# EAGLE design MotionSign (EAGLE 9.3.0)
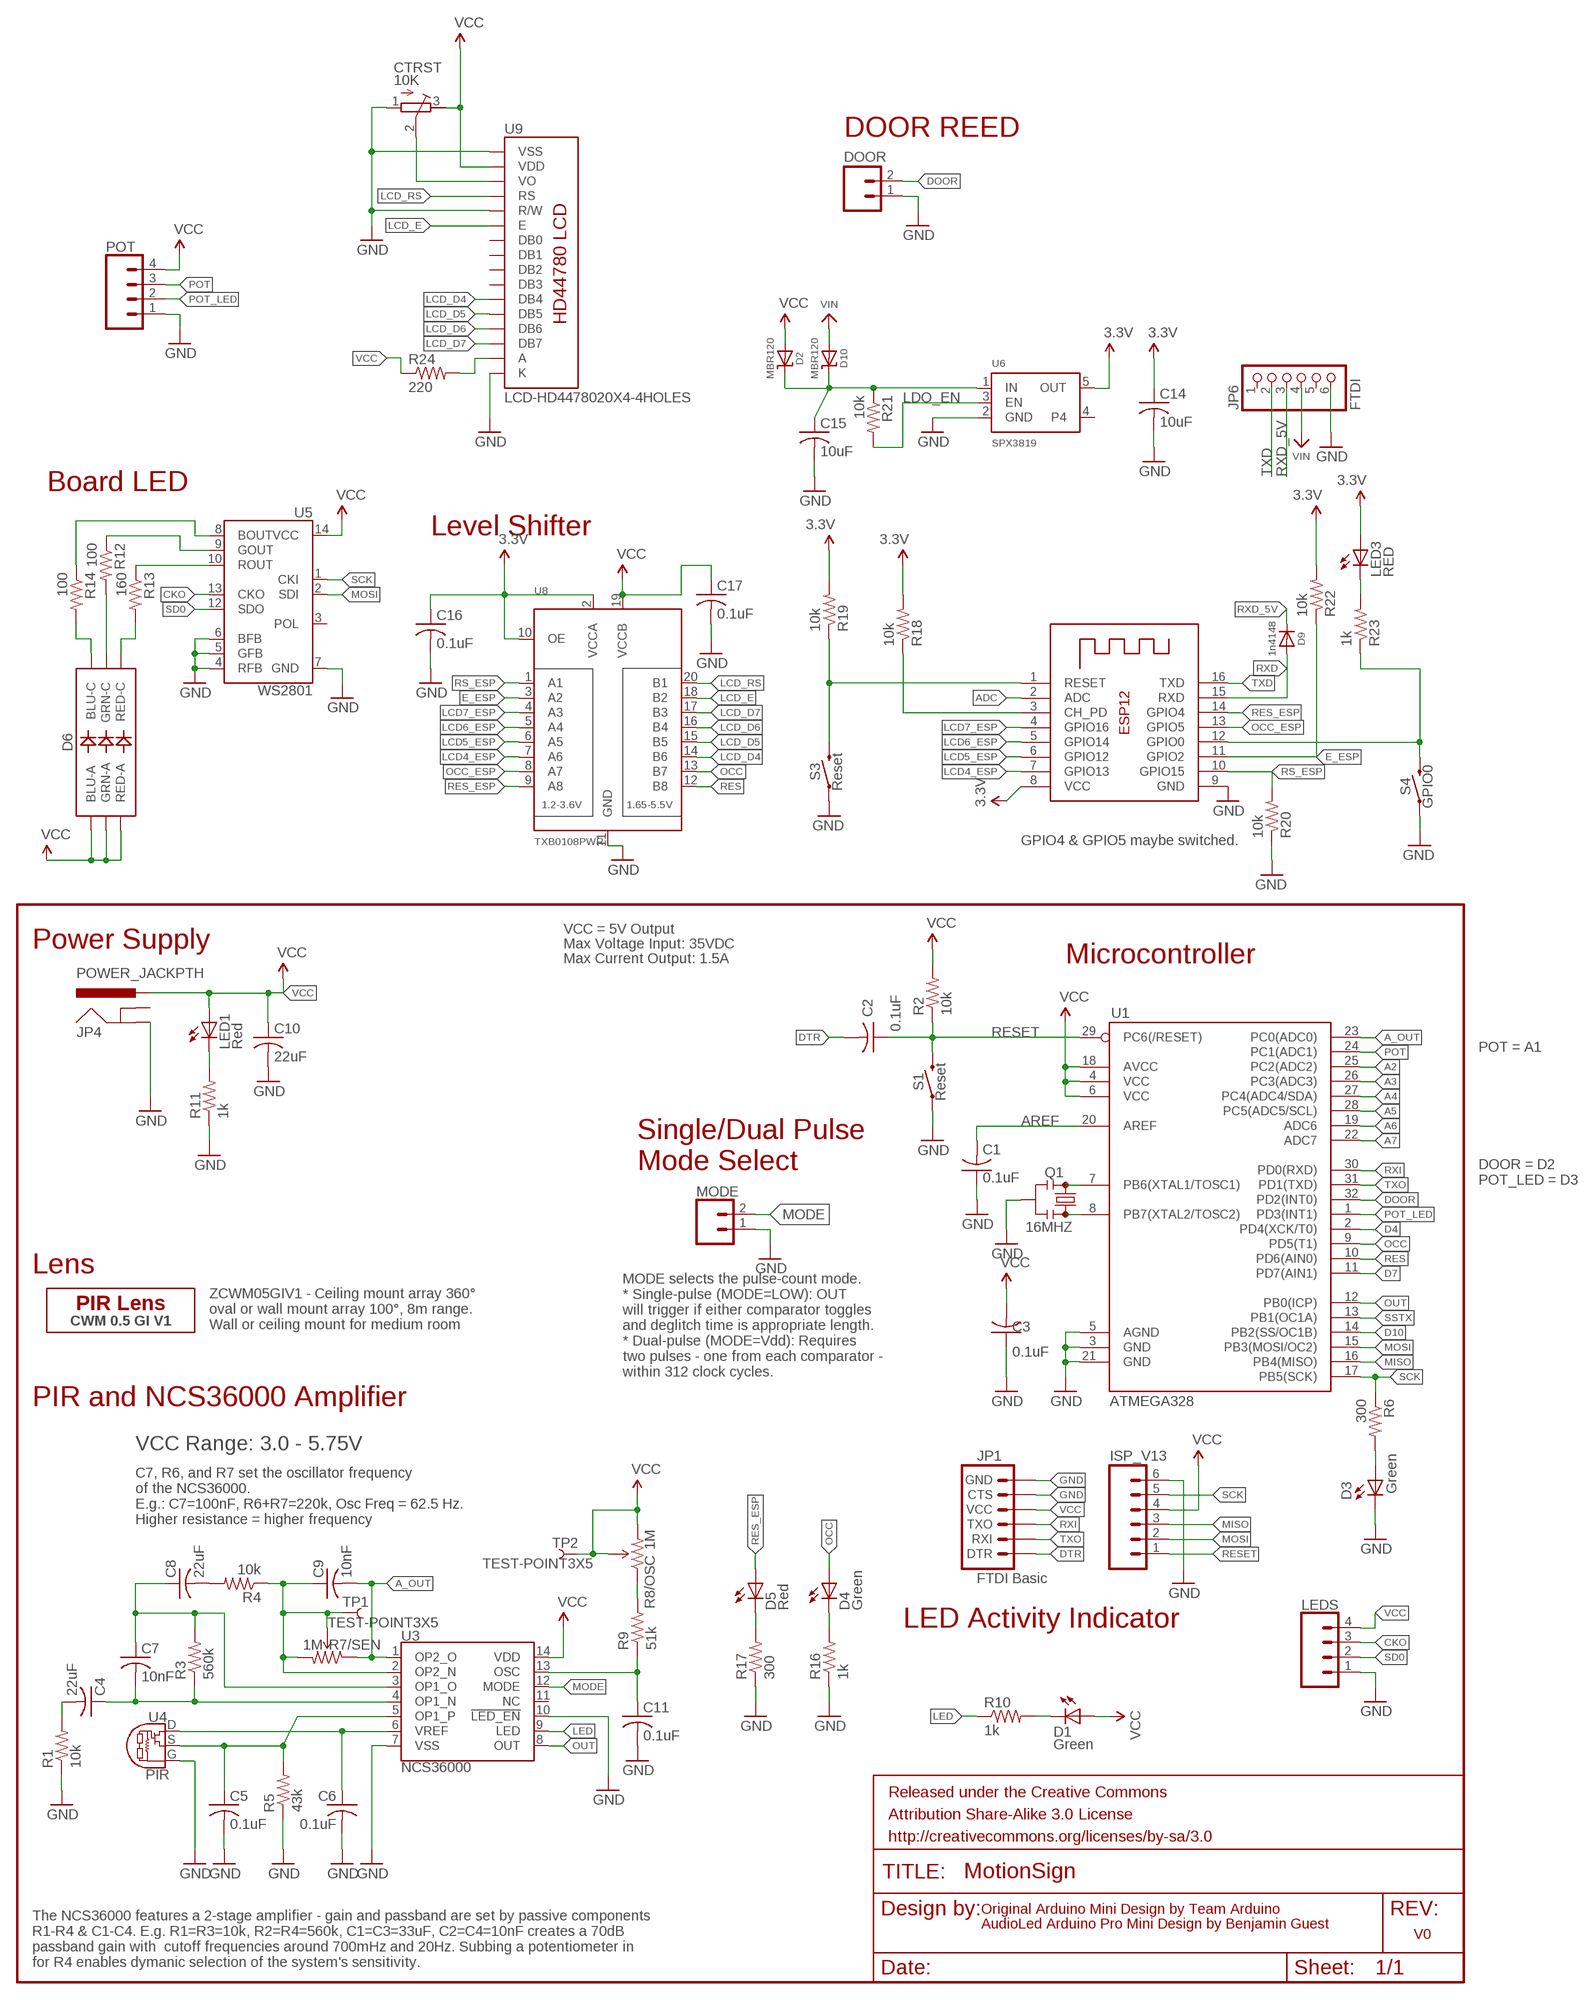
[diagram p0: schematic, sheet 1]

## Parts
C1  0.1uF  C-USC0805  [C0805]
C2  0.1uF  C-USC0805  [C0805]
C3  0.1uF  C-USC0805  [C0805]
C4  22uF  C-USC0805  [C0805]
C5  0.1uF  C-USC0805  [C0805]
C6  0.1uF  C-USC0805  [C0805]
C7  10nF  C-USC0805  [C0805]
C8  22uF  C-USC0805  [C0805]
C9  10nF  C-USC0805  [C0805]
C10  22uF  C-USC0805  [C0805]
C11  0.1uF  C-USC0805  [C0805]
C14  10uF  C-USC0805  [C0805]
C15  10uF  C-USC0805  [C0805]
C16  0.1uF  C-USC0805  [C0805]
C17  0.1uF  C-USC0805  [C0805]
CTRST  10K  R-TRIMM3296W  [RTRIM3296W]
D1  Green  LEDCHIPLED_0805  [CHIPLED_0805]
D2  MBR120  DIODE-SCHOTTKYSOD-123  [SOD-123]
D3  Green  LEDCHIPLED_0805  [CHIPLED_0805]
D4  Green  LEDCHIPLED_0805  [CHIPLED_0805]
D5  Red  LEDCHIPLED_0805  [CHIPLED_0805]
D6  LED-RGBNO_IC  [LED-TRICOLOR-5050]
D9  1n4148  DIODESOD-323  [SOD-323]
D10  MBR120  DIODE-SCHOTTKYSOD-123  [SOD-123]
DOOR  CONN_02JST-PTH-2  [JST-2-PTH]
FRAME1  FRAME-LETTER  [CREATIVE_COMMONS]
ISP_V13  M06SIP  [1X06]
JP1  FTDI Basic  ARDUINO_SERIAL_PROGRAMPTH  [1X06]
JP4  POWER_JACKPTH  [POWER_JACK_PTH]
JP6  FTDI  HEADER-1X670MIL  [1X06_ROUND_70]
LED1  Red  LEDCHIPLED_0805  [CHIPLED_0805]
LED3  RED  LEDCHIP-LED0805  [CHIP-LED0805]
LEDS  CONN_04JST-PTH  [JST-4-PTH]
MODE  CONN_02  [1X02]
POT  CONN_04JST-PTH  [JST-4-PTH]
Q1  16MHZ  RESONATOR16MHZ  [RESONATOR-SMD]
R1  10k  R-US_M0805  [M0805]
R2  10k  R-US_M0805  [M0805]
R3  560k  R-US_M0805  [M0805]
R4  10k  R-US_M0805  [M0805]
R5  43k  R-US_M0805  [M0805]
R6  300  R-US_M0805  [M0805]
R7/SEN  1M  TRIMPOTTX33X-1M  [TRIMPOT-TC33X]
R8/OSC  1M  TRIMPOTTX33X-1M  [TRIMPOT-TC33X]
R9  51k  R-US_M0805  [M0805]
R10  1k  R-US_M0805  [M0805]
R11  1k  R-US_M0805  [M0805]
R12  100  R-US_M0805  [M0805]
R13  160  R-US_M0805  [M0805]
R14  100  R-US_M0805  [M0805]
R16  1k  R-US_M0805  [M0805]
R17  300  R-US_M0805  [M0805]
R18  10k  R-US_M0805  [M0805]
R19  10k  R-US_M0805  [M0805]
R20  10k  R-US_M0805  [M0805]
R21  10k  R-US_M0805  [M0805]
R22  10k  R-US_M0805  [M0805]
R23  1k  R-US_M0805  [M0805]
R24  220  R-US_0204/7  [0204/7]
S1  Reset  MOMENTARY-SWITCH-SPST-SMD-5.2-REDUNDANT  [TACTILE_SWITCH_SMD_5.2MM]
S3  Reset  MOMENTARY-SWITCH-SPST-SMD-5.2-REDUNDANT  [TACTILE_SWITCH_SMD_5.2MM]
S4  GPIO0  MOMENTARY-SWITCH-SPST-SMD-5.2-REDUNDANT  [TACTILE_SWITCH_SMD_5.2MM]
TP1  TEST-POINT3X5  [PAD.03X.05]
TP2  TEST-POINT3X5  [PAD.03X.05]
U1  ATMEGA328  ATMEGA168  [TQFP32-08]
U3  NCS36000  [SO14]
U4  PIR  [PIR]
U5  WS2801  [SOP-14]
U6  SPX3819  VREG_SOT23-5  [SOT23-5]
U8  TXB0108PWR  [TSSOP20]
U9  LCD-HD4478020X4-4HOLES  LCD-HD44780  [LCD-20X4-1HOLE_NOSILK]
U$1  CWM 0.5 GI V1  PIR-LENSCWM-0.5-GI-V1  [LENS-CWM-0.5-GI-V1]
X2  ESP-12  [ESP-12]

## Nets
3.3V: C14.1 C16.1 LED3.A R18.2 R19.2 R22.2 U6.5(OUT) U8.2(VCCA) U8.10(OE) X2.8(VCC)
A2: U1.25(PC2(ADC2))
A3: U1.26(PC3(ADC3))
A4: U1.27(PC4(ADC4/SDA))
A5: U1.28(PC5(ADC5/SCL))
A6: U1.19(ADC6)
A7: U1.22(ADC7)
A_OUT: C9.2 R7/SEN.1(CCW) U1.23(PC0(ADC0)) U3.1(OP2_O)
ADC: X2.2(ADC)
AREF: C1.2 U1.20(AREF)
CH_PD: R18.1 X2.3(CH_PD)
CKO: LEDS.3 U5.13(CKO)
D4: U1.2(PD4(XCK/T0))
D7: U1.11(PD7(AIN1))
D10: U1.14(PB2(SS/OC1B))
DOOR: DOOR.2 U1.32(PD2(INT0))
DTR: C2.2 JP1.1(DTR)
E_ESP: R22.1 U8.3(A2) X2.11(GPIO2)
GND [vcc]: C1.1 C3.1 C5.2 C6.2 C10.2 C11.2 C14.2 C15.2 C16.2 C17.2 CTRST.1(A) D3.C DOOR.1 ISP_V13.6 JP1.5(CTS) JP1.6(GND) JP4.GND JP6.6 LEDS.1 MODE.1 POT.1 Q1.2 R1.1 R5.1 R11.1 R16.1 R17.1 R20.1 S1.1 S1.2 S3.1 S3.2 S4.1 S4.2 U1.3(GND) U1.5(AGND) U1.21(GND) U3.7(VSS) U3.10(!LED_EN!) U4.G U5.4(RFB) U5.5(GFB) U5.6(BFB) U5.7(GND) U6.2(GND) U8.11(GND) U9.P$1(VSS) U9.P$5(R/W) U9.P$16(K) X2.9(GND)
GPIO0: R23.1 S4.3 S4.4 X2.12(GPIO0)
LCD4_ESP: U8.7(A6) X2.7(GPIO13)
LCD5_ESP: U8.6(A5) X2.6(GPIO12)
LCD6_ESP: U8.5(A4) X2.5(GPIO14)
LCD7_ESP: U8.4(A3) X2.4(GPIO16)
LCD_D4: U8.14(B6) U9.P$11(DB4)
LCD_D5: U8.15(B5) U9.P$12(DB5)
LCD_D6: U8.16(B4) U9.P$13(DB6)
LCD_D7: U8.17(B3) U9.P$14(DB7)
LCD_E: U8.18(B2) U9.P$6(E)
LCD_RS: U8.20(B1) U9.P$4(RS)
LDO_EN: R21.2 U6.3(EN)
LED: R10.1 U3.9(LED)
MISO: ISP_V13.3 U1.16(PB4(MISO))
MODE: MODE.2 U3.12(MODE)
MOSI: ISP_V13.2 U1.15(PB3(MOSI/OC2)) U5.2(SDI)
N$1: Q1.3 U1.8(PB7(XTAL2/TOSC2))
N$2: Q1.1 U1.7(PB6(XTAL1/TOSC1))
N$3: C6.1 U3.6(VREF) U4.D
N$4: LED1.C R11.2
N$5: C5.1 R5.2 U3.5(OP1_P) U4.S
N$6: C4.2 R1.2
N$7: D3.A R6.2
N$8: C8.2 R4.2
N$9: C4.1 C7.2 R3.1 U3.4(OP1_N)
N$10: C7.1 C8.1 R3.2 U3.3(OP1_O)
N$11: C9.1 R4.1 R7/SEN.2(WIPER) R7/SEN.3(CW) TP1.P$1 U3.2(OP2_N)
N$12: C11.1 R9.1 U3.13(OSC)
N$13: R8/OSC.1(CCW) R9.2
N$14: D1.C R10.2
N$15: R14.1 U5.8(BOUT)
N$16: R13.1 U5.10(ROUT)
N$17: LED3.C R23.2
N$18: D5.C R17.2
N$19: R12.1 U5.9(GOUT)
N$20: D6.4(BLU-C) R14.2
N$21: D6.6(GRN-C) R12.2
N$22: D6.5(RED-C) R13.2
N$23: C15.1 D2.C D10.C R21.1 U6.1(IN)
N$24: D4.C R16.2
N$25: R24.2 U9.P$15(A)
OCC: D4.A U1.9(PD5(T1)) U8.13(B7)
OCC_ESP: U8.8(A7) X2.13(GPIO5)
OUT: U1.12(PB0(ICP)) U3.8(OUT)
POT: POT.3 U1.24(PC1(ADC1))
POT_LED: POT.2 U1.1(PD3(INT1))
RES: U1.10(PD6(AIN0)) U8.12(B8)
RES_ESP: D5.A U8.9(A8) X2.14(GPIO4)
RESET: C2.1 ISP_V13.1 R2.1 S1.3 S1.4 U1.29(PC6(/RESET))
RESET_HZA: R19.1 S3.3 S3.4 X2.1(RESET)
RS_ESP: R20.2 U8.1(A1) X2.10(GPIO15)
RXD: D9.A X2.15(RXD)
RXD_5V: D9.C JP6.3
RXI: JP1.3(TXO) U1.30(PD0(RXD))
SCK: ISP_V13.5 R6.1 U1.17(PB5(SCK)) U5.1(CKI)
SD0: LEDS.2 U5.12(SDO)
SSTX: U1.13(PB1(OC1A))
TXD: JP6.2 X2.16(TXD)
TXO: JP1.2(RXI) U1.31(PD1(TXD))
VCC [gnd]: C3.2 C10.1 C17.1 CTRST.3(E) D1.A D2.A D6.1(GRN-A) D6.2(RED-A) D6.3(BLU-A) ISP_V13.4 JP1.4(VCC) JP4.PWR LED1.A LEDS.4 POT.4 R2.2 R8/OSC.2(WIPER) R8/OSC.3(CW) R24.1 TP2.P$1 U1.4(VCC) U1.6(VCC) U1.18(AVCC) U3.14(VDD) U5.14(VCC) U8.19(VCCB) U9.P$2(VDD)
VIN: D10.A JP6.4
VO: CTRST.2(S) U9.P$3(VO)
Unconnected: JP4.GNDBREAK JP6.1 JP6.5 U3.11(NC) U5.3(POL) U6.4 U9.P$7(DB0) U9.P$8(DB1) U9.P$9(DB2) U9.P$10(DB3)

## Notes on the sheet
- DOOR REED
- Board LED
- Level Shifter
- GPIO4 & GPIO5 maybe switched.
- VCC = 5V Output
- Power Supply | Max Voltage Input: 35VDC
- Max Current Output: 1.5A | Microcontroller
- POT = A1
- Single/Dual Pulse
  Mode Select
- DOOR = D2
  POT_LED = D3
- Lens
- ZCWM05GIV1 - Ceiling mount array 360°
  oval or wall mount array 100°, 8m range.
  Wall or ceiling mount for medium room
- MODE selects the pulse-count mode.
  * Single-pulse (MODE=LOW): OUT 
  will trigger if either comparator toggles
  and deglitch time is appropriate length.
  * Dual-pulse (MODE=Vdd): Requires 
  two pulses - one from each comparator -
  within 312 clock cycles.
- PIR and NCS36000 Amplifier
- VCC Range: 3.0 - 5.75V
- C7, R6, and R7 set the oscillator frequency 
  of the NCS36000.
  E.g.: C7=100nF, R6+R7=220k, Osc Freq = 62.5 Hz.
  Higher resistance = higher frequency
- LED Activity Indicator
- Original Arduino Mini Design by Team Arduino
- AudioLed Arduino Pro Mini Design by Benjamin Guest
- V0
- The NCS36000 features a 2-stage amplifier - gain and passband are set by passive components
  R1-R4 & C1-C4. E.g. R1=R3=10k, R2=R4=560k, C1=C3=33uF, C2=C4=10nF creates a 70dB
  passband gain with  cutoff frequencies around 700mHz and 20Hz. Subbing a potentiometer in
  for R4 enables dymanic selection of the system's sensitivity.

## Library data of the parts
C1-C11 C14 C15 = MotionSign:C-US: CAPACITOR, American symbol
C16 C17 = rcl:C-US: CAPACITOR, American symbol; SPICEPREFIX: C
CTRST = MotionSign:R-TRIMM: Trimm resistor
D1 D3-D5 LED1 LED3 = led:LED: LED OSRAM: - CHIPLED LG R971, LG N971, LY N971, LG Q971, LY Q971, LO R971, LY R971 LH N974, LH R974 LS Q976, LO Q976, LY Q976 LO Q996 - Hyper CHIPLED LW Q18S LB Q993, LB Q99A, LB R99A - SideLED LS A670, LO A670, LY A670, LG A670, LP A670 LB A673, LV A673, LT A673, LW A673 LH A674 LY A675 LS A676, LA A676, LO A676, LY A676, LW A676 LS A679, LY A679, LG A679 - Hyper Micro SIDELED® LS Y876, LA Y876, LO Y876, LY Y876 LT Y87S - SmartLED LW L88C, LW L88S LB L89C, LB L89S, LG L890 LS L89K, LO L89K, LY L89K LS L896, LA L896, LO L896, LY L896 - TOPLED LS T670, LO T670, LY T670, LG T670, LP T670 LSG T670, LSP T670, LSY T670, LOP T670, LYG T670 LG T671, LOG T671, LSG T671 LB T673, LV T673, LT T673, LW T673 LH T674 LS T676, LA T676, LO T676, LY T676, LB T676, LH T676, LSB T676, LW T676 LB T67C, LV T67C, LT T67C, LS T67K, LO T67K, LY T67K, LW E67C LS E67B, LA E67B, LO E67B, LY E67B, LB E67C, LV E67C, LT E67C LW T67C LS T679, LY T679, LG T679 LS T770, LO T770, LY T770, LG T770, LP T770 LB T773, LV T773, LT T773, LW T773 LH T774 LS E675, LA E675, LY E675, LS T675 LS T776, LA T776, LO T776, LY T776, LB T776 LHGB T686 LT T68C, LB T68C - Hyper Mini TOPLED® LB M676 - Mini TOPLED Santana® LG M470 LS M47K, LO M47K, LY M47K Source: http://www.osram.convergy.de LUXEON: - LUMILED® LXK2-PW12-R00, LXK2-PW12-S00, LXK2-PW14-U00, LXK2-PW14-V00 LXK2-PM12-R00, LXK2-PM12-S00, LXK2-PM14-U00 LXK2-PE12-Q00, LXK2-PE12-R00, LXK2-PE12-S00, LXK2-PE14-T00, LXK2-PE14-U00 LXK2-PB12-K00, LXK2-PB12-L00, LXK2-PB12-M00, LXK2-PB14-N00, LXK2-PB14-P00, LXK2-PB14-Q00 LXK2-PR12-L00, LXK2-PR12-M00, LXK2-PR14-Q00, LXK2-PR14-R00 LXK2-PD12-Q00, LXK2-PD12-R00, LXK2-PD12-S00 LXK2-PH12-R00, LXK2-PH12-S00 LXK2-PL12-P00, LXK2-PL12-Q00, LXK2-PL12-R00 Source: www.luxeon.com KINGBRIGHT: KA-3528ASYC Source: www.kingbright.com
D2 D10 = MotionSign:DIODE-SCHOTTKY
D6 = MotionSign:LED-RGB: LED-RGB 6 pin RGB LED (no common connector) Packages: PLCC-6 LED-TRICOLOR-5050 - No built-in IC SparkFun Products: Digital Sandbox <https://www.sparkfun.com/products/12651> LED- SMD RGB <https://www.sparkfun.com/products/10866>; PROD_ID: DIO-10298
D9 = MotionSign:DIODE: Diode SMA Model Volts Amps Type Vf Ir Digikey # Notes SSA34-E3 40V 3A Schottky 480mV @ 3A 200uA @ 40V SSA34-E3/61TGITR-ND CDBA120-G 20V 1A Schottky 500mV @ 1A 500uA @ 20V 641-1014-6-ND REEL MBRA210 10V 2A Schottky 350mV @ 2A 700uA @ 10V MBRA210LT3 SOD-123 Model Volts Amps Type Vf Ir Order # Notes BAT54T1G 30V 200mA Schottky 800mV @ 200mA 2uA @ 25V BAT54T1GOSTR-ND B0530W 30V 500mA Schottky 430mV @ 500mA 130uA @ 30V B0530W-FDICT-ND REEL MBR120 20V 1A Schottky 340mV @ 1A MBR120VLSFT1GOSCT-ND SOD-323 Model Volts Amps Type Vf Ir Order # Notes PMEG2005EJ 20V 500mA Schottky 355mV @ 500mA 568-4110-1-ND ZLLS410 10V 570mA Schottky 380mV @ 570mA ZLLS410CT-ND 1N4148WS 75V 150mA Silicon/Simple 1V 1N4148WSFSCT-ND REEL SOD-523 Model Volts Amps Type Vf Ir Order # Notes BAT54XV2 30V 200mA Schottky 0.8V @ 100mA BAT54XV2CT-ND TB751S 30V 30mA Schottky RB751S-40TE61CT-ND SOT23-R/W (R = Solder Paste/Reflow Ovens, W = Hand-Soldering) Model Volts Amps Type Vf Ir Order # Notes BAT54FILM 40V 300mA Schottky 497-7162-1-ND POWERDI-5 Model Volts Amps Type Vf Ir Order # Notes PDS560 60V 5A Schottky 670mV @ 5A 150uA @ 60V PDS560DICT-ND
DOOR = MotionSign:CONN_02: Multi connection point. Often used as Generic Header-pin footprint for 0.1 inch spaced/style header connections On any of the 0.1 inch spaced packages, you can populate with these: Break Away Headers - Straight <https://www.sparkfun.com/products/116> (PRT-00116) Break Away Male Headers - Right Angle <https://www.sparkfun.com/products/553> (PRT-00553) Female Headers <https://www.sparkfun.com/products/115> (PRT-00115) Break Away Headers - Machine Pin <https://www.sparkfun.com/products/117> (PRT-00117) Break Away Female Headers - Swiss Machine Pin <https://www.sparkfun.com/products/743> (PRT-00743) For SCREWTERMINALS and SPRING TERMINALS visit here: Screw Terimnals on SparkFun.com <https://www.sparkfun.com/search/results?term=Screw+Terminals> (5mm/3.5mm/2.54mm spacing) This device is also useful as a general connection point to wire up your design to another part of your project. Our various solder wires solder well into these plated through hole pads. Hook-Up Wire - Assortment (Stranded, 22 AWG) <https://www.sparkfun.com/products/11375> (PRT-11375) Hook-Up Wire - Assortment (Solid Core, 22 AWG) <https://www.sparkfun.com/products/11367> (PRT-11367) View the entire wire category on our website here <https://www.sparkfun.com/categories/141> Special notes: Molex polarized connector foot print use with: PRT-08233 with associated crimp pins and housings. 2.54_SCREWTERM for use with PRT-10571. 3.5mm Screw Terminal footprints for PRT-08084 5mm Screw Terminal footprints for use with PRT-08432; PROD_ID: CONN-09863; SKU: PRT-09914
FRAME1 = MotionSign:FRAME-LETTER: Schematic Frame Standard 8.5x11 US Letter frame
ISP_V13 = MotionSign:M06: Header 6 Standard 6-pin 0.1" header. Use with straight break away headers (SKU : PRT-00116), right angle break away headers (PRT-00553), swiss pins (PRT-00743), machine pins (PRT-00117), and female headers (PRT-00115). Molex polarized connector foot print use with SKU : PRT-08094 with associated crimp pins and housings. NOTES ON THE VARIANTS LOCK and LOCK_LONGPADS... This footprint was designed to help hold the alignment of a through-hole component (i.e. 6-pin header) while soldering it into place. You may notice that each hole has been shifted either up or down by 0.005 of an inch from it's more standard position (which is a perfectly straight line). This slight alteration caused the pins (the squares in the middle) to touch the edges of the holes. Because they are alternating, it causes a "brace" to hold the component in place. 0.005 has proven to be the perfect amount of "off-center" position when using our standard breakaway headers. Although looks a little odd when you look at the bare footprint, once you have a header in there, the alteration is very hard to notice. Also, if you push a header all the way into place, it is covered up entirely on the bottom side. This idea of altering the position of holes to aid alignment will be further integrated into the Sparkfun Library for other footprints. It can help hold any component with 3 or more connection pins.
JP1 = MotionSign:ARDUINO_SERIAL_PROGRAM
JP4 = MotionSign:POWER_JACK: Power Jack This is the standard 5.5mm barrel jack for power. The PTH is the most common, proven, reliable, footprint. The Slot footprint only works if the mill layer is transmitted to the PCB fab house so be warned. Mating wall wart : TOL-00298 (and others); PROD_ID: CONN-08197
JP6 = MotionSign:HEADER-1X6: PIN HEADER
LEDS POT = MotionSign:CONN_04: Multi connection point. Often used as Generic Header-pin footprint for 0.1 inch spaced/style header connections On any of the 0.1 inch spaced packages, you can populate with these: Break Away Headers - Straight <https://www.sparkfun.com/products/116> (PRT-00116) Break Away Male Headers - Right Angle <https://www.sparkfun.com/products/553> (PRT-00553) Female Headers <https://www.sparkfun.com/products/115> (PRT-00115) Break Away Headers - Machine Pin <https://www.sparkfun.com/products/117> (PRT-00117) Break Away Female Headers - Swiss Machine Pin <https://www.sparkfun.com/products/743> (PRT-00743) For SCREWTERMINALS and SPRING TERMINALS visit here: Screw Terimnals on SparkFun.com <https://www.sparkfun.com/search/results?term=Screw+Terminals> (5mm/3.5mm/2.54mm spacing) This device is also useful as a general connection point to wire up your design to another part of your project. Our various solder wires solder well into these plated through hole pads. Hook-Up Wire - Assortment (Stranded, 22 AWG) <https://www.sparkfun.com/products/11375> (PRT-11375) Hook-Up Wire - Assortment (Solid Core, 22 AWG) <https://www.sparkfun.com/products/11367> (PRT-11367) View the entire wire category on our website here <https://www.sparkfun.com/categories/141> Special notes: Molex polarized connector foot print use with SKU : PRT-08231 with associated crimp pins and housings. 1MM SMD Version SKU: PRT-10208; PROD_ID: WIRE-13531; SF_ID: PRT-09916
MODE = MotionSign:CONN_02: Multi connection point. Often used as Generic Header-pin footprint for 0.1 inch spaced/style header connections On any of the 0.1 inch spaced packages, you can populate with these: Break Away Headers - Straight <https://www.sparkfun.com/products/116> (PRT-00116) Break Away Male Headers - Right Angle <https://www.sparkfun.com/products/553> (PRT-00553) Female Headers <https://www.sparkfun.com/products/115> (PRT-00115) Break Away Headers - Machine Pin <https://www.sparkfun.com/products/117> (PRT-00117) Break Away Female Headers - Swiss Machine Pin <https://www.sparkfun.com/products/743> (PRT-00743) For SCREWTERMINALS and SPRING TERMINALS visit here: Screw Terimnals on SparkFun.com <https://www.sparkfun.com/search/results?term=Screw+Terminals> (5mm/3.5mm/2.54mm spacing) This device is also useful as a general connection point to wire up your design to another part of your project. Our various solder wires solder well into these plated through hole pads. Hook-Up Wire - Assortment (Stranded, 22 AWG) <https://www.sparkfun.com/products/11375> (PRT-11375) Hook-Up Wire - Assortment (Solid Core, 22 AWG) <https://www.sparkfun.com/products/11367> (PRT-11367) View the entire wire category on our website here <https://www.sparkfun.com/categories/141> Special notes: Molex polarized connector foot print use with: PRT-08233 with associated crimp pins and housings. 2.54_SCREWTERM for use with PRT-10571. 3.5mm Screw Terminal footprints for PRT-08084 5mm Screw Terminal footprints for use with PRT-08432
Q1 = MotionSign:RESONATOR: Resonator Small SMD resonator. Used, eg, on the Arduino Pro/ Pro Mini boards. 8MHz- XTAL-08895 16MHz- XTAL-08900; PROD_ID: XTAL-08900
R1-R6 R9-R14 R16-R24 = MotionSign:R-US_: RESISTOR, American symbol
R7/SEN R8/OSC = MotionSign:TRIMPOT: Various small potentiometers for "set-and-forget" applications; PROD_ID: RES-13431
S1 S3 S4 = MotionSign:MOMENTARY-SWITCH-SPST: Momentary Switch (Pushbutton) - SPST Normally-open (NO) SPST momentary switches (buttons, pushbuttons). Variants PTH-12MM - 12mm square, through-hole Momentary Pushbutton Switch - 12mm Square <https://www.sparkfun.com/products/9190> (COM-09190) PTH-6.0MM, PTH-6.0MM-KIT - 6.0mm square, through-hole Mini Pushbutton Switch <https://www.sparkfun.com/products/97> (COM-00097) KIT package intended for soldering kit's - only one side of pads' copper is exposed. PTH-RIGHT-ANGLE-KIT - Right-angle, through-hole Right Angle Tactile Button <https://www.sparkfun.com/products/10791> - Used on SparkFun BigTime Watch Kit <https://www.sparkfun.com/products/11734> SMD-12MM - 12mm square, surface-mount Tactile Button - SMD (12mm) <https://www.sparkfun.com/products/12993> (COM-12993) Used on SparkFun PicoBoard <https://www.sparkfun.com/products/11888> SMD-4.5MM - 4.5mm Square Trackball Switch Used on SparkFun Blackberry Trackballer Breakout <https://www.sparkfun.com/products/13169> SMD-4.6MMX2.8MM - 4.60mm x 2.80mm, surface mount Used on SparkFun SAMD21 Mini Breakout <https://www.sparkfun.com/products/13664> SMD-5.2MM, SMD-5.2-REDUNDANT - 5.2mm square, surface-mount Mini Pushbutton Switch - SMD <https://www.sparkfun.com/products/8720> (COM-08720) Used on Arduino Pro Mini <https://www.sparkfun.com/products/11114> REDUNDANT package connects both switch circuits together SMD-6.0X3.5MM - 6.0 x 3.5mm, surface mount Momentary Reset Switch SMD <https://www.sparkfun.com/products/8229> (COM-08229) SMD-6.2MM-TALL - 6.2mm square, surface mount Tactile Button - SMD (6mm) <https://www.sparkfun.com/products/12992> Used on SparkFun Digital Sandbox <https://www.sparkfun.com/products/12651> SMD-RIGHT-ANGLE - Right-angle, surface mount Used on SparkFun Block for Intel® Edison - Arduino <https://www.sparkfun.com/products/13036>; PROD_ID: SWCH-08247; SF_SKU: COM-08720
TP1 TP2 = MotionSign:TEST-POINT: Bare copper test points for troubleshooting or ICT
U1 = MotionSign:ATMEGA168
U3 = MotionSign:NCS36000; PROD_ID: IC-13432
U4 = MotionSign:PIR; PROD_ID: IC-13430
U5 = MotionSign:WS2801: WS2801 3 Channel Constant Current LED Driver with programmable PWM outputs. Datasheet: http://www.sparkfun.com/datasheets/Components/LED/WS2801.pdf
U6 = MotionSign:VREG_SOT23-5: SOT23-5 Fixed Voltage Regulators Part Current Out V Out V In V Dropout θJA (°C/W) TJ (°C) Digikey Part No. ADP121 150mA 3.3V 3.4-5.5V 0.09V @ 150mA -- -- ADP121-AUJZ33R7CT-ND ADP121 150mA 3.0V 3.1-5.5V 0.09V @ 150mA -- -- ADP121-AUJZ30R7CT-ND ADP122 300mA 3.3V 3.4-5.5V 0.085V @ 300mA -- -- ADP122AUJZ-3.3-R7CT-ND ADP1712 300mA 3.3V 3.5-5.5V 0.17V @ 300mA -- -- ADP1712AUJZ-3.3-R7TR-ND AP7311 (Low Cost) 150mA 3.3V 3.5-6V 0.15V @ 150mA -- -- AP7311-33WG-7DICT-ND LD39015M18R 150mA 1.8V 1.9V-5.5V 0.08V @ 100mA -- -- 497-6977-1-ND LP2985A-33DBVR 150mA 3.3V 3.3-16V 0.28V @ 150mA 206 150 296-18479-1-ND MCP1824T-3302E/OT 300mA 3.3V 3.5V-6V 0.2V @ 300mA -- -- MCP1824T-3302E/OTCT-ND MIC5205-2.5YM5 TR 150mA 2.5V 2.7-16V 0.165V @ 150mA -- -- 576-1257-2-ND MIC5205-3.0YM5 TR 150mA 3.0V 3.2V-16V 0.165V @ 150mA -- -- 576-1258-2-ND MIC5205-3.3YM5 TR 150mA 3.3V 3.5V-16V 0.165V @ 150mA -- -- 576-1259-2-ND TPS780330220 150mA 3.3V+2.2V 3.6-5.5V 250mV Max -- -- 296-23332-1-ND TDA3663/N1,135 100mA 3.3V 3.5-45V 0.18V @ 50mA -- -- 568-5343-1-ND Max operating temp can be calculated using θJA, TJ (max junction temperature), and power in watts. Set the "Maximum Ambient Temperature" until it reaches TJ ("Max Junction Temperature"), which is the absolute limit for safe use of the regulator: Heat Sink Temperature Calculator <http://www.daycounter.com/Calculators/Heat-Sink-Temperature-Calculator.phtml> For example, With 12V source into a 3.3V LP2985 and a 30mA load, we are dissipating (12V-3.3V) * 0.03A = 0.261W. With a θJA of 206 °C/W, a TJ of 150°C, and 261mW we can safely use the chip without a heat sink up to 75°C (=147.1°C Junction Temperature).
U8 = MotionSign:TXB0108PWR: 8-Bit Bi-Directional Level Shifter 1.2V-3.6V (VCCA) to 1.65V-5.5V (VCCB) bi-directional level shifter with auto direction sensing. Max data rate - VCCA 1.8V: 20Mbps (50ns), VCCA 3.3V: 100Mbps (10ns) Digikey: 296-21527-1-ND
U9 = MotionSign:LCD-HD44780
U$1 = MotionSign:PIR-LENS
X2 = MotionSign:ESP-12

## Module ED
Ports: 

### Library data of the parts

## Net classes
0 default: width 0.254 mm, drill 0.254 mm, clearance 0.254 mm
1 vcc: width 0.508 mm, drill 0.381 mm, clearance 0.254 mm
2 gnd: width 0.508 mm, drill 0.381 mm, clearance 0.254 mm
3 raw: width 0.508 mm, drill 0.381 mm, clearance 0.254 mm
4 3.3V: width 0.508 mm, drill 0.381 mm, clearance 0.254 mm

## Board
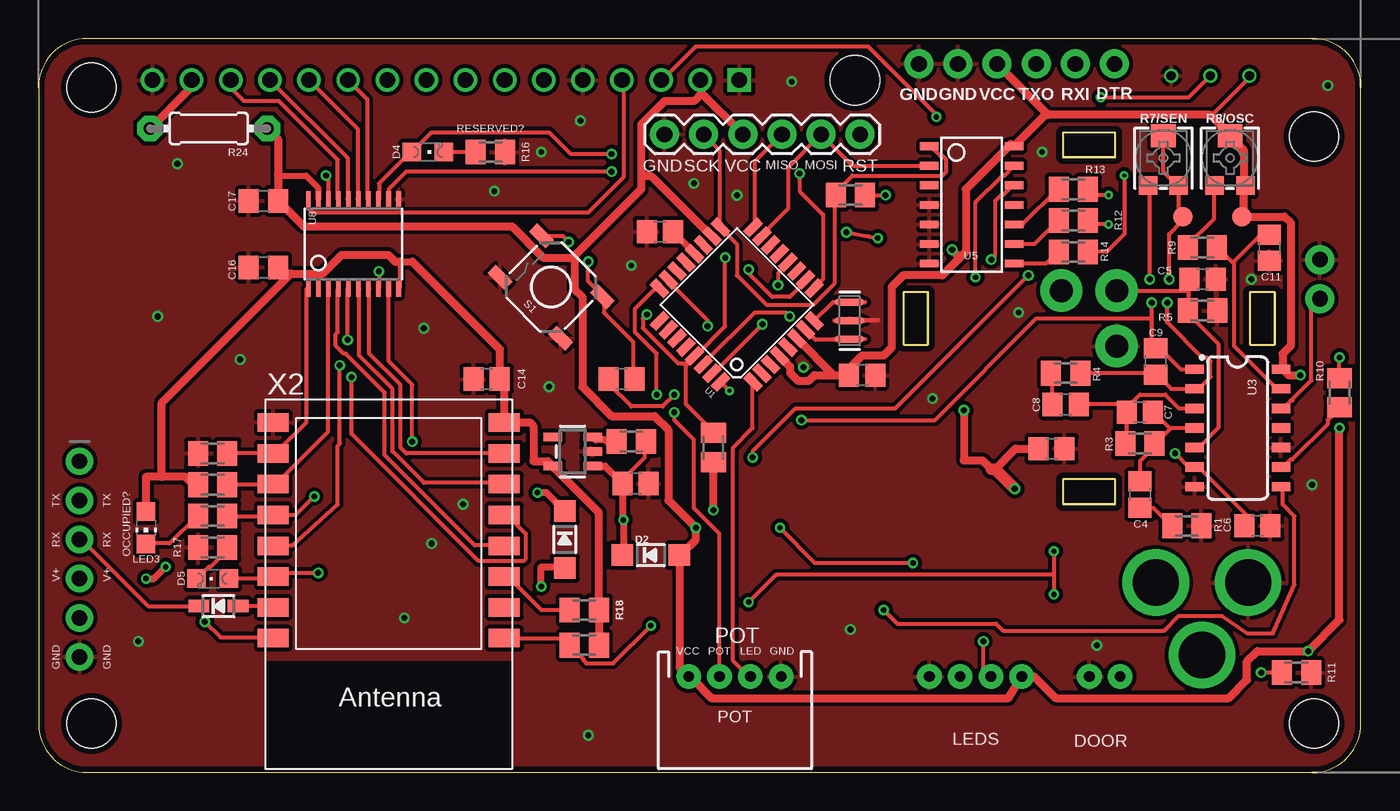
[diagram p1: board, top side]
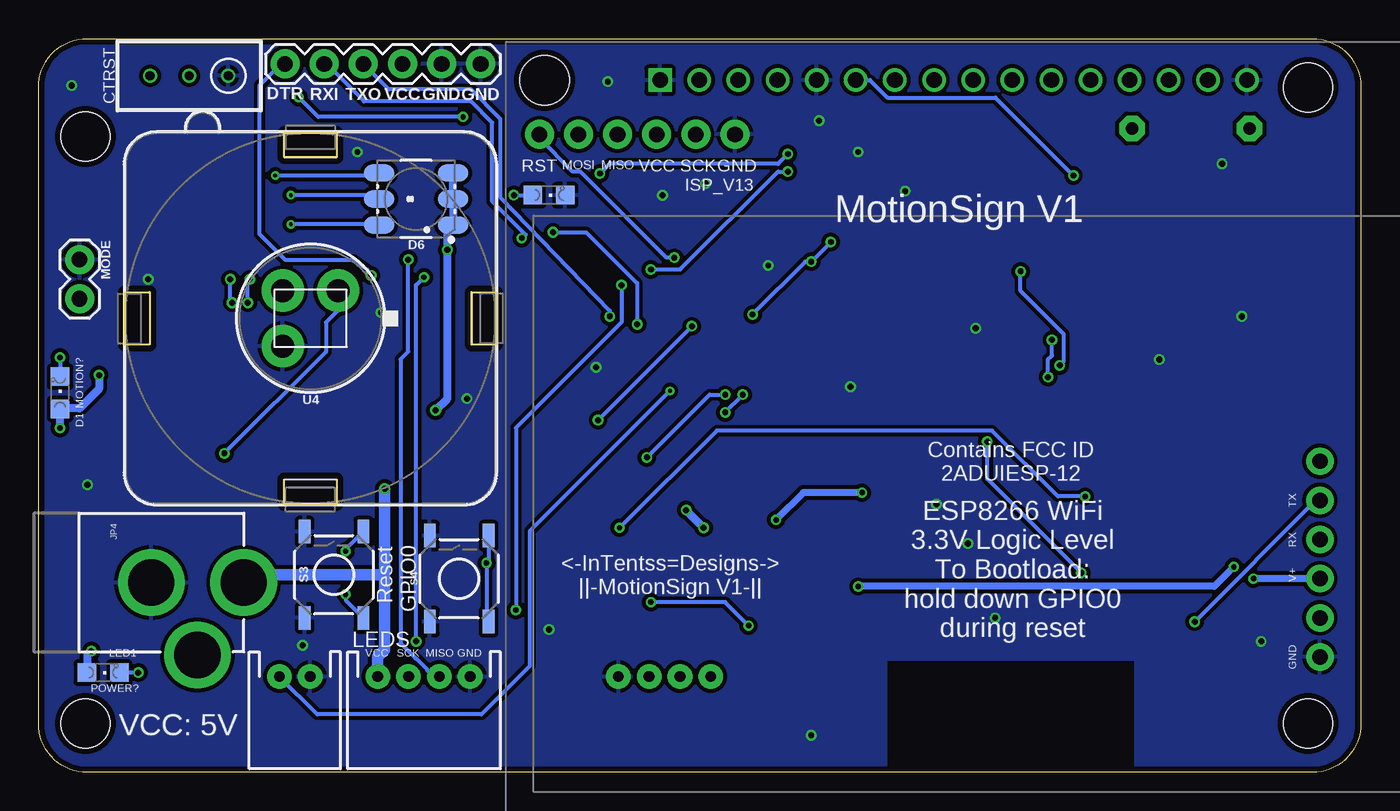
[diagram p2: board, bottom side, seen from below]

Size 85.85 x 47.62 mm. Coordinates in mm from the lower left corner, seen from the top.
Outline: 0,44.45 0,3.17 arc90 3.17,0 82.68,0 arc90 85.85,3.17 85.85,44.45 arc90 82.68,47.62 3.17,47.62 arc90 0,44.45
Copper layers (1*16): Top 0.035559375mm / dielectric 1.6mm / Bottom 0.035559375mm
Design rules "oshpark-2layer-auto-routing *": minimum track width 10mil, minimum drill 10mil, track to track 10mil, track to pad 8mil, pad to pad 8mil, via to via 8mil, smd to smd 6mil, copper to edge 15mil, drill to drill 6mil, minimum pad ring 6mil, minimum via ring 6mil, stop-mask expansion 2.5mil, vias tented up to drill 16mil, thermal gap 10mil
Holes 3.17 mm at 82.8,3.17 3.43,3.17 3.43,44.45 82.8,41.28

### Footprints (pad centres in the part's own frame; a part is rotated, then mirrored left to right if it is on the bottom)
C0805 = smd 1.3 x 1.5: 1 -0.85,0; 2 0.85,0
C0805' = smd 1.3 x 1.5: 1 -0.95,0; 2 0.95,0
RTRIM3296W = drill 0.61: 1 0,-2.54; 2 0,0; 3 0,2.54
CHIPLED_0805 = smd 1.2 x 1.2: A 0,-1.05; C 0,1.05
SOD-123 = smd 1.4 x 1.4: A 1.85,0; C -1.85,0
LED-TRICOLOR-5050 = smd 2 x 1.1: 1 -2.4,1.7; 2 -2.4,0; 3 -2.4,-1.7; 4 2.4,-1.7; 5 2.4,0; 6 2.4,1.7
SOD-323 = smd 1.35 x 0.8: A 1.27,0; C -1.27,0
JST-2-PTH = drill 0.7 pad 1.6: 1 -1,0; 2 1,0
1X06 = drill 1.016 pad 1.88: 1 0,0; 2 2.54,0; 3 5.08,0; 4 7.62,0; 5 10.16,0; 6 12.7,0
POWER_JACK_PTH = drill 2.997 pad 4.318: GND 0,7.7; GNDBREAK 4.7,10.7; PWR 0,13.7
1X06_ROUND_70 = drill 1 pad 1.778: 1 -6.35,0; 2 -3.81,0; 3 -1.27,0; 4 1.27,0; 5 3.81,0; 6 6.35,0
CHIP-LED0805 = smd 1.2 x 1.2: A 0,-1.05; C 0,1.05
JST-4-PTH = drill 0.7 pad 1.6: 1 -3,0; 2 -1,0; 3 1,0; 4 3,0
1X02 = drill 1.016 pad 1.88: 1 0,0; 2 2.54,0
RESONATOR-SMD = smd 0.45 x 1.905: 1 -1.2,0; 2 0,0; 3 1.2,0
M0805 = smd 1.3 x 1.6: 1 -0.95,0; 2 0.95,0
TRIMPOT-TC33X = smd 1.2 x 1.2: 1 -1,-1.8; 3 1,-1.8 | smd 1.6 x 1.5: 2 0,1.45
0204/7 = drill 0.813 pad 1.676 octagon: 1 -3.81,0; 2 3.81,0
TACTILE_SWITCH_SMD_5.2MM = smd 1.524 x 0.762: 1 -2.794,1.905; 2 2.794,1.905; 3 -2.794,-1.905; 4 2.794,-1.905
PAD.03X.05 = smd 1.27 x 1.27: P$1 0,0
TQFP32-08 = smd 1.27 x 0.559: 1 -4.293,2.8; 2 -4.293,2; 3 -4.293,1.2; 4 -4.293,0.4; 5 -4.293,-0.4; 6 -4.293,-1.2; 7 -4.293,-2; 8 -4.293,-2.8; 17 4.293,-2.8; 18 4.293,-2; 19 4.293,-1.2; 20 4.293,-0.4; 21 4.293,0.4; 22 4.293,1.2; 23 4.293,2; 24 4.293,2.8 | smd 0.559 x 1.27: 9 -2.8,-4.293; 10 -2,-4.293; 11 -1.2,-4.293; 12 -0.4,-4.293; 13 0.4,-4.293; 14 1.2,-4.293; 15 2,-4.293; 16 2.8,-4.293; 25 2.8,4.293; 26 2,4.293; 27 1.2,4.293; 28 0.4,4.293; 29 -0.4,4.293; 30 -1.2,4.293; 31 -2,4.293; 32 -2.8,4.293
SO14 = smd 0.6 x 1.2: 1 -3.81,-2.8; 2 -2.54,-2.8; 3 -1.27,-2.8; 4 0,-2.8; 5 1.27,-2.8; 6 2.54,-2.8; 7 3.81,-2.8; 8 3.81,2.8; 9 2.54,2.8; 10 1.27,2.8; 11 0,2.8; 12 -1.27,2.8; 13 -2.54,2.8; 14 -3.81,2.8
PIR = drill 1.5 pad 2.75: D -1.8,-1.8; G 1.8,1.8; S 1.8,-1.8
SOP-14 = smd 0.5 x 1.2: 1 -3.81,-2.75; 2 -2.54,-2.75; 3 -1.27,-2.75; 4 0,-2.75; 5 1.27,-2.75; 6 2.54,-2.75; 7 3.81,-2.75; 8 3.81,2.75; 9 2.54,2.75; 10 1.27,2.75; 11 0,2.75; 12 -1.27,2.75; 13 -2.54,2.75; 14 -3.81,2.75
SOT23-5 = smd 0.55 x 1.2: 1 -0.95,-1.3; 2 0,-1.3; 3 0.95,-1.3; 4 0.95,1.3; 5 -0.95,1.3
TSSOP20 = smd 0.305 x 0.991: 1 -2.925,-2.918; 2 -2.275,-2.918; 3 -1.625,-2.918; 4 -0.975,-2.918; 5 -0.325,-2.918; 6 0.325,-2.918; 7 0.975,-2.918; 8 1.625,-2.918; 9 2.275,-2.918; 10 2.925,-2.918; 11 2.925,2.918; 12 2.275,2.918; 13 1.625,2.918; 14 0.975,2.918; 15 0.325,2.918; 16 -0.325,2.918; 17 -0.975,2.918; 18 -1.625,2.918; 19 -2.275,2.918; 20 -2.925,2.918
LCD-20X4-1HOLE_NOSILK = drill 1.016 square: P$1 10,57.5 | drill 1.016: P$2 12.54,57.5; P$3 15.08,57.5; P$4 17.62,57.5; P$5 20.16,57.5; P$6 22.7,57.5; P$7 25.24,57.5; P$8 27.78,57.5; P$9 30.32,57.5; P$10 32.86,57.5; P$11 35.4,57.5; P$12 37.94,57.5; P$13 40.48,57.5; P$14 43.02,57.5; P$15 45.56,57.5; P$16 48.1,57.5 | hole 3.2: 2.5,57.5
ESP-12 = smd 2 x 1.2: 1 -7.5,4.5; 2 -7.5,2.5; 3 -7.5,0.5; 4 -7.5,-1.5; 5 -7.5,-3.5; 6 -7.5,-5.5; 7 -7.5,-7.5; 8 -7.5,-9.5; 9 7.5,-9.5; 10 7.5,-7.5; 11 7.5,-5.5; 12 7.5,-3.5; 13 7.5,-1.5; 14 7.5,0.5; 15 7.5,2.5; 16 7.5,4.5

### Placement (x,y rotation side)
C1  40.35,35.09 0 top
C2  37.85,25.53 180 top
C3  53.47,25.78 180 top
C4  71.5,18.03 270 top
C5  75.56,32 0 top
C6  79.12,16 0 top
C7  71.5,23.37 0 top
C8  66.67,23.88 180 top
C9  72.52,26.67 90 top
C10  65.76,21.01 0 top
C11  79.91,34.05 270 top
C14  29.08,25.53 180 top
C15  38.76,18.75 0 top
C16  0.1uF  [C0805']  14.6,32.77 180 top
C17  0.1uF  [C0805']  14.6,37.08 180 top
CTRST  76.07,45.21 90 bottom
D1  84.45,24.64 0 bottom
D2  39.75,14.1 0 top
D3  52.7,37.47 270 bottom
D4  25.27,40.26 270 top
D5  11.3,12.57 90 top
D6  61.34,37.21 180 bottom
D9  11.68,10.8 0 top
D10  34.16,15.11 270 top
DOOR  69.22,6.22 180 bottom
FRAME1  7.26,-56.52 0 top  (outside the outline)
ISP_V13  53.34,41.4 180 top
JP1  69.85,45.97 0 bottom
JP4  86.23,12.32 270 bottom
JP6  2.67,13.84 270 top
LED1  81.66,6.48 270 bottom
LED3  6.98,15.88 180 top
LEDS  60.83,6.22 180 bottom
MODE  83.19,33.27 270 bottom
POT  45.21,6.22 180 top
Q1  52.66,29.32 90 top
R1  74.55,16 180 top
R2  43.81,21.08 270 top
R3  71.5,21.34 180 top
R4  66.67,25.91 180 top
R5  75.56,29.97 180 top
R6  52.7,37.47 0 top
R7/SEN  73.03,39.88 0 top
R8/OSC  77.34,39.88 0 top
R9  75.55,34.06 180 top
R10  84.45,24.64 90 top
R11  81.66,6.48 180 top
R12  67.18,35.81 0 top
R13  67.18,37.85 0 top
R14  67.18,33.78 0 top
R16  29.34,40.26 180 top
R17  11.3,14.61 0 top
R18  35.43,10.54 0 top
R19  35.43,8.25 0 top
R20  11.3,20.7 0 top
R21  38.48,21.46 180 top
R22  11.3,18.67 180 top
R23  11.3,16.64 180 top
R24  11.05,41.78 180 top
S1  33.27,31.5 135 top
S3  66.67,12.83 90 bottom
S4  58.55,12.57 90 bottom
TP1  74.3,36.07 0 top
TP2  78.11,36.07 0 top
U1  45.34,30.35 135 top
U3  77.85,22.35 270 top
U4  68.2,29.46 180 bottom
U5  60.58,36.83 270 top
U6  34.67,20.83 90 top
U8  20.45,34.29 0 top
U9  55.5,-12.57 0 bottom
U$1  68.2,29.46 0 bottom
X2  22.73,13.21 180 top

### Tracks (layer width: path | path; a pad name or v marks a point on that pad's centre or on a via)
3.3V
  Top 0.254: 18.19,31.43 U8.2 | 23.43,33.15 23.43,31.43 U8.10
  Top 0.305: 18.16,32.38 18.16,31.46 18.19,31.43
  Top 0.457: R22.2 10.03,18.67 | 23.43,33.15 24.26,33.15
  Top 0.508: LED3.A 6.98,19.18 8,19.18 | 8,19.18 9.52,19.18 10.03,18.67 | 23.43,33.15 23.14,33.15 22.69,33.59 19.67,33.59 18.46,32.38 18.16,32.38 16.37,32.38 | 24.26,33.15 29.93,27.47 C14.1 30.23,25.23 X2.8 31.9,22.71 32.13,22.48 32.13,20.19 33.06,20.19 U6.5 36.38,16.87 R18.2 R19.2 | 16.37,32.38 8,24 8,19.18 | 16.37,32.38 15.95,32.38 C16.1
A_OUT  (via drill 0.38)
  Top 0.254: U3.1 74.17,26.16 72.9,27.43 72.52,27.43 C9.2 72.52,27.56 72.26,27.81 72.26,29.46 | v72.14,32 72.14,37.97 R7/SEN.1 | 72.26,29.46 v72.26,30.48 | v43.43,28.96 43.43,29.34 40.89,31.88 U1.23 | v49.53,22.86 58.18,22.86 64.78,29.46 72.26,29.46
  Bottom 0.254: v72.14,32 72.26,31.88 v72.26,30.48 | v49.53,22.86 v43.43,28.96
AREF
  Top 0.254: U1.20 42.48,33.66 42.36,33.85
  Top 0.457: C1.2 42.29,34 42.29,33.91 42.36,33.85
CH_PD
  Top 0.254: R18.1 32.64,10.54 30.35,12.83 X2.3
CKO  (via drill 0.35, 0.38)
  Top 0.254: LEDS.3 61.34,6.72 v61.34,8.51 | U5.13 62.69,38.73 62.57,38.73 60.83,36.99 v60.83,32.13
  Bottom 0.254: v61.34,8.51 61.34,31.62 v60.83,32.13
DOOR  (via drill 0.25)
  Top 0.254: v44.86,24.76 U1.32 | U1.32
  Bottom 0.254: v44.86,24.76 53.95,15.67 53.95,6.91 57.09,3.77 67.76,3.77 DOOR.2
DTR  (via drill 0.38)
  Top 0.254: v41.28,24.51 40.51,23.75 38.48,23.75 37.08,25.15 37.08,25.53 C2.2 | v46.36,20.45 46.36,20.83 49.15,23.62 55.63,23.62 v64.26,32.26
  Bottom 0.254: v41.28,24.51 42.29,24.51 v46.36,20.45 | v64.26,32.26 64.52,32.51 64.52,32.64 65.41,33.27 69.85,33.27 71.5,34.93 71.5,44.58 70.1,45.97 JP1.1
E_ESP
  Top 0.254: U8.3 18.8,31.37 18.8,22.1 15.49,18.8 15.24,18.8 X2.11 15.11,18.67 R22.1
GND  (via drill 0.38, 0.4)
  Top 0.305: 52.68,29.34 54.48,29.34
  Top 0.508: Q1.2 52.68,29.34
  other vias: 49.66,26.29 13.08,26.8 25.53,14.86 27.56,17.4 25.02,28.83 33.15,25.02 52.7,9.27 68.71,8.25 83.69,44.58 82.68,18.67 42.55,38.23 45.34,37.47 38.48,32.89 29.59,37.72 35.18,42.29 35.69,2.41 23.75,10.03 7.75,29.59 9.02,39.5 6.48,8.51 32.64,40.26 78.74,32 65.15,40.26 58.04,24.26 63.63,29.85 48.89,44.83
  pour Top: -0.25,48.01 -0.51,-0.25 86.11,-0.25 86.36,48.01
  pour Bottom: -0.51,48.51 -0.76,-0.51 86.36,-0.51 86.61,48.51
GPIO0  (via drill 0.35)
  Top 0.254: R23.1 15.16,16.64 X2.12 16.71,16.71 v17.91,17.91 | v56.77,13.59 50.42,13.59 v48.13,15.88
  Bottom 0.254: S4.4 56.64,13.72 v56.77,13.59 56.77,9.91 S4.3 | v17.91,17.91 19.68,17.91 23.96,22.19 41.82,22.19 v48.13,15.88
LCD4_ESP
  Top 0.254: U8.7 21.46,31.37 21.46,27.18 23.5,25.15 23.5,21.08 23.88,20.7 X2.7
LCD5_ESP
  Top 0.254: U8.6 20.83,31.37 20.83,27.05 22.99,24.89 22.99,20.83 25.02,18.8 30.23,18.8 X2.6
LCD6_ESP  (via drill 0.38)
  Top 0.254: v20.07,28.07 20.07,31.37 U8.5 | v20.32,25.65 20.32,21.97 28.58,13.72 31.5,13.72 31.62,13.84 31.62,15.49 30.35,16.76 X2.5
  Bottom 0.254: v20.07,28.07 20.07,27.05 20.32,26.8 v20.32,25.65
LCD7_ESP
  Top 0.254: U8.4 19.43,31.37 19.43,28.57 19.3,28.45 19.3,27.69 19.81,27.18 19.94,27.18 22.48,24.64 22.48,20.57 28.32,14.73 30.23,14.73 X2.4
LCD_D4
  Top 0.254: U8.14 21.34,37.21 21.34,43.69 20.19,44.83 U9.P$11
LCD_D5
  Top 0.254: U8.15 20.7,37.21 20.7,41.78 17.65,44.83 U9.P$12
LCD_D6
  Top 0.254: U8.16 20.07,37.21 20.07,39.88 15.11,44.83 U9.P$13
LCD_D7
  Top 0.254: U8.17 19.43,37.21 19.43,39.75 15.62,43.56 13.34,43.56 12.48,44.42 U9.P$14
LCD_E  (via drill 0.38)
  Top 0.254: U8.18 18.82,38.58 v18.67,38.73
  Bottom 0.254: U9.P$6 31.88,44.93 30.73,43.78 23.72,43.78 v18.67,38.73
LCD_RS
  Top 0.254: U8.20 17.53,37.08 17.53,36.58 17.78,36.32 35.69,36.32 37.97,38.61 37.97,44.83 U9.P$4
LDO_EN
  Top 0.457: R21.2 36.89,21.46 36.77,21.59 36.16,21.59 U6.3
LED
  Top 0.254: U3.9 80.77,19.81 81.28,20.32 81.41,20.32 83.69,22.61 83.69,22.86 84.45,23.62 R10.1
MISO
  Top 0.254: ISP_V13.3 46.48,39.62 46.48,35.43 U1.16
MODE
  Top 0.254: U3.12 80.77,23.62 81.28,24.13 81.41,24.13 81.41,24.21 82.64,25.44 82.64,30.19 MODE.2
MOSI
  Top 0.254: U5.2 52.83,39.37 ISP_V13.2 48.64,39.24 48.64,36.58 46.99,34.93 U1.15
N$1
  Top 0.254: U1.8 51.57,30.52 Q1.3
N$2
  Top 0.254: U1.7 50.45,28.07 51.69,28.07 51.74,28.12 Q1.1
N$3  (via drill 0.38)
  Top 0.254: C6.1 78.74,15.75 78.74,16.38 75.31,19.81 U3.6 74.68,19.81 v73.79,20.7
  Bottom 0.254: v73.79,20.7 67.18,27.3 67.18,29.21 66.42,29.97 66.42,31.24 U4.D
N$4  (via drill 0.38)
  Top 0.254: R11.2 v79.38,6.48
  Bottom 0.254: v79.38,6.48 LED1.C
N$5
  Top 0.254: U3.5 75.31,21.08 76.58,22.35 76.58,27.81 74.68,29.72 74.68,29.97 | 74.68,29.97 74.68,31.24 | 74.68,31.24 74.68,32 C5.1 | 74.68,29.97 R5.2 | 74.68,31.24 70.1,31.24 U4.S
N$6
  Top 0.254: C4.2 71.5,17.14 72.39,17.14 73.79,15.75 R1.2
N$7  (via drill 0.38)
  Top 0.254: R6.2 v54.99,37.47
  Bottom 0.254: v54.99,37.47 D3.A
N$8
  Top 0.254: C8.2 65.79,23.88 65.79,25.91 R4.2
N$9
  Top 0.254: U3.4 73.53,22.35 73.47,22.29 | 73.47,22.29 72.52,21.34 R3.1 72.64,21.34 71.5,20.19 C4.1 | 73.47,22.29 72.39,23.37 C7.2
N$10
  Top 0.254: U3.3 74.04,23.62 73.15,24.51 71.5,24.51 70.74,23.75 70.74,23.37 C7.1 | C8.1 70.74,23.88 C7.1 | R3.2 70.61,21.34 70.61,23.37 C7.1
N$11  (via drill 0.38)
  Top 0.254: R7/SEN.2 73.03,38.99 73.91,38.1 R7/SEN.3 74.04,37.97 74.04,36.32 TP1.P$1 74.17,36.07 74.17,35.69 73.41,34.93 v73.41,32 | 72.52,25.91 73.53,24.89 U3.2 75.31,24.89 76.07,25.65 76.07,26.67 75.82,26.92 75.56,26.92 73.28,29.21 v73.28,30.48 | 72.52,25.91 R4.1 | 72.52,25.91 C9.1
  Bottom 0.254: v73.41,32 73.41,30.61 v73.28,30.48
N$12
  Top 0.254: U3.13 80.39,24.89 77.6,27.69 77.6,33.02 77.53,33.08 | 77.53,33.08 76.58,34.04 R9.1 | 77.53,33.08 79.25,34.8 79.88,34.8 C11.1
N$13
  Top 0.254: R8/OSC.1 76.33,37.97 76.33,35.94 74.55,34.16 R9.2
N$14  (via drill 0.38)
  Top 0.254: R10.2 v84.45,26.92
  Bottom 0.254: v84.45,26.92 D1.C
N$15
  Top 0.254: U5.8 65.41,33.02 66.17,33.78 R14.1
N$16
  Top 0.254: U5.10 63.88,35.56 66.17,37.85 R13.1
N$17
  Top 0.254: LED3.C 6.98,14.86 8.51,14.86 10.29,16.64 R23.2
N$18
  Top 0.254: D5.C 10.29,12.57 11.05,13.34 11.18,13.34 12.19,14.35 12.19,14.61 R17.2
N$19
  Top 0.254: U5.9 64.64,34.29 66.17,35.81 R12.1
N$20  (via drill 0.25)
  Top 0.254: v70.48,38.73 70.48,34.93 69.34,33.78 R14.2
  Bottom 0.254: v70.48,38.73 63.75,38.73 D6.4
N$21  (via drill 0.25)
  Top 0.254: v69.47,35.56 68.2,35.56 R12.2
  Bottom 0.254: v69.47,35.56 63.75,35.56 D6.6
N$22  (via drill 0.25)
  Top 0.254: v69.47,37.47 68.2,37.47 R13.2
  Bottom 0.254: v69.47,37.47 63.75,37.47 D6.5
N$23  (via drill 0.35)
  Top 0.254: R21.1 39.37,21.46 39.37,20.45 37.85,18.92 C15.1
  Top 0.457: U6.1 36.78,19.88 C15.1 37.91,16.45 v37.97,16.38 37.97,14.17 D2.C | D10.C 32.97,18.16 v32.39,18.16
  Bottom 0.457: v32.39,18.16 36.19,18.16 v37.97,16.38
N$24
  Top 0.254: R16.2 D4.C
N$25
  Top 0.508: R24.2 9.94,44.48 U9.P$15
OCC  (via drill 0.38)
  Top 0.254: U8.13 22.1,37.21 22.1,38.23 24.13,40.26 D4.A 24.26,40.26 25.53,41.53 33.15,41.53 34.54,40.13 v37.21,40.13 | v49.4,38.86 49.4,37.72 50.93,36.2 50.93,32 50.42,31.5 U1.9
  Bottom 0.254: v49.4,38.86 48.77,39.5 37.85,39.5 v37.21,40.13
OCC_ESP  (via drill 0.38)
  Top 0.254: v22.1,32.51 22.1,31.5 U8.8 | v19.56,26.42 19.56,21.34 19.43,21.21 19.43,17.4 16.51,14.73 15.24,14.73 X2.13
  Bottom 0.254: v22.1,32.51 22.1,31.24 19.3,28.45 19.3,26.67 v19.56,26.42
OUT  (via drill 0.38)
  Top 0.254: v48.01,31.62 48.01,32.39 48.64,33.02 U1.12 | U3.8 80.77,18.54 80.77,17.4 81.53,16.64 81.53,12.19 80.14,9.02 78.47,9.02 76.82,10.16 74.04,10.16 73.08,9.2 62.61,9.2 62.16,9.65 55.75,9.65 v54.86,10.54
  Bottom 0.254: v54.86,10.54 54.86,22.35 48.01,29.21 v48.01,31.62
POT  (via drill 0.38)
  Top 0.254: v40.13,24.51 40.13,27.18 38.73,28.57 38.73,30.1 40,31.37 40.26,31.37 U1.24 | v41.28,23.37 41.28,22.86 42.55,21.59 42.55,17.14 44.2,15.49 44.2,6.22 POT.3
  Bottom 0.254: v41.28,23.37 v40.13,24.51
POT_LED
  Top 0.254: U1.1 46.36,25.27 46.36,22.35 45.08,21.08 45.08,7.24 46.1,6.22 POT.2
RES  (via drill 0.38)
  Top 0.254: v37.21,38.99 23.88,38.99 22.73,37.85 22.73,37.21 U8.12 | v46.1,32.64 46.1,32.39 47.62,30.86 48.77,30.86 49.78,31.88 U1.10
  Bottom 0.254: v37.21,38.99 37.85,38.99 44.2,32.64 v46.1,32.64
RES_ESP  (via drill 0.38)
  Top 0.254: v24.26,21.46 24.26,25.15 22.73,26.67 22.73,31.37 U8.9 | v18.16,12.95 15.37,12.95 15.24,12.83 X2.14 15.11,12.7 14.99,12.57 D5.A
  Bottom 0.254: v24.26,21.46 24.26,19.05 v18.16,12.95
RESET  (via drill 0.38)
  Top 0.254: 42.1,26.48 42.04,26.42 42.04,23.88 43.81,22.1 R2.1 | 42.1,26.48 42.55,26.92 U1.29 42.67,27.05 44.58,28.96 v44.58,33.4 | C2.1 38.61,25.53 38.61,27.94 36.7,29.85 36.7,30.86 S1.3 36.58,30.99 35.69,31.88 v35.69,33.15 | v34.42,34.42 34.04,34.8 32.77,34.8 S1.4 | v39.5,29.72 39.24,29.46 39.24,28.83 41.53,26.54 42.04,26.54 42.1,26.48
  Bottom 0.254: v34.42,34.42 v35.69,33.15 36.07,33.15 v39.5,29.72 | ISP_V13.1 53.34,41.15 51.18,38.99 50.67,38.99 45.08,33.4 v44.58,33.4
RESET_HZA  (via drill 0.35)
  Top 0.254: v65.91,14.35 65.91,12.83 | 65.91,12.83 v65.91,11.56 | 65.91,12.83 47.88,12.83 v46.1,11.05 | X2.1 34.03,8.71 R19.1 35.35,7.39 35.35,7.3 35.58,7.07 37.3,7.07 v39.75,9.52
  Bottom 0.254: S3.4 65.91,14.48 v65.91,14.35 | v65.91,11.56 65.91,11.18 S3.3 | v39.75,9.52 41.28,11.05 v46.1,11.05
RS_ESP
  Top 0.254: U8.1 17.4,31.37 17.4,22.73 15.49,20.83 15.24,20.83 X2.10 15.11,20.7 R20.2
RXD
  Top 0.254: D9.A 15.11,10.8 X2.15
RXD_5V
  Top 0.254: D9.C 7.11,10.8 2.79,15.11 JP6.3
RXI  (via drill 0.38)
  Top 0.254: v48.77,29.59 48.51,29.85 46.48,29.85 43.18,26.54 U1.30
  Bottom 0.254: v48.77,29.59 48.77,29.97 55.88,37.34 55.88,42.42 57.78,44.32 63.12,44.32 JP1.3
SCK
  Top 0.254: U5.1 57.91,40.64 58.55,40.01 58.67,40.01 58.93,39.75 58.93,38.99 58.67,38.73 52.83,38.73 51.82,37.72 51.82,37.47 R6.1 51.69,37.47 51.69,31.75 50.29,30.35 47.24,30.35 45.34,32.26 45.34,34.29 44.32,35.31 U1.17 44.2,35.43 44.2,40.39 ISP_V13.5
SD0  (via drill 0.38)
  Top 0.254: v61.85,33.27 62.1,33.53 62.1,37.08 62.48,37.47 62.61,37.47 63.25,38.1 U5.12
  Bottom 0.254: v61.85,33.27 61.85,27.3 62.36,26.8 62.36,8.38 61.38,7.4 61.34,7.4 60.65,6.71 60.65,6.68 60.2,6.22 LEDS.2
TXD  (via drill 0.38)
  Top 0.254: v10.8,9.78 11.81,8.76 15.11,8.76 X2.16
  Bottom 0.254: v10.8,9.78 2.92,17.65 JP6.2
TXO  (via drill 0.35, 0.38)
  Top 0.254: v46.99,29.08 43.81,25.91 U1.31 | v54.48,34.67 53.85,34.8 v52.45,35.05
  Bottom 0.254: v46.99,29.08 46.99,31.75 50.29,35.05 v52.45,35.05 | v54.48,34.67 54.23,34.89 56.39,37.05 56.39,42.17 57.78,43.55 64.72,43.55 67.15,45.97 JP1.2
VCC  (via drill 0.38, 0.4)
  Top 0.254: U8.19 | CTRST.3 78.61,45.09 76.14,42.61
  Top 0.381: 15.55,38.73 17.36,38.73 18.17,37.92 18.16,37.91 U8.19
  Top 0.457: 43.56,34.93 U1.18
  Top 0.508: v81.92,25.78 81.15,25.78 80.9,26.04 U3.14 80.77,26.16 80.77,27.18 81.28,27.69 81.28,35.69 80.9,36.07 TP2.P$1 78.23,36.2 78.23,37.97 R8/OSC.3 78.23,38.23 78.23,40.39 77.47,41.15 R8/OSC.2 77.34,41.4 76.14,42.61 76.07,42.67 65.53,42.67 | 59.82,33.4 60.2,33.78 60.2,37.85 63.12,40.77 U5.14 65.36,42.67 65.53,42.67 | 59.82,33.4 58.67,32.26 56.13,32.26 55.37,31.5 55.37,27.56 54.86,27.05 53.47,27.05 52.62,26.2 C3.2 51.61,25.78 | v43.81,17.02 R2.2 | 43.05,44.07 43.05,44.83 U9.P$2 | ISP_V13.4 43.05,44.07 | 34.67,33.4 32.77,33.4 30.73,35.43 17.21,35.43 C17.1 15.55,38.73 15.55,41.09 R24.1 | 34.67,33.4 39.12,37.85 39.12,38.73 | 39.12,38.73 39.12,42.04 40.64,43.56 42.55,43.56 43.05,44.07 | 34.67,33.4 34.8,33.27 34.8,31.37 35.31,30.86 35.31,25.02 37.21,23.11 40,23.11 40.89,22.22 40.89,17.65 v42.67,15.88 42.67,15.11 41.78,14.22 D2.A 41.66,14.1 41.66,6.73 42.16,6.22 POT.4 42.42,6.1 43.69,4.83 62.97,4.83 LEDS.4 64.64,6.22 66.04,4.83 77.27,4.83 78.45,6.01 78.45,7.21 79.12,7.87 v82.42,7.87 84.45,9.91 v84.45,22.35 | U1.6 51.61,25.78 | 39.12,38.73 39.54,38.73 arc-45 39.9,38.59 43.56,34.93 | v59.31,33.91 59.82,33.4 | 62.1,19.68 63.42,21.01 C10.1 | v60.07,23.5 60.07,20.26 61.28,20.26 61.85,19.68 | U1.4 48.8,26.33 48.8,25.93 49.3,25.43 50.01,25.43 50.37,25.78 51.61,25.78 | JP1.4 65.53,42.67
  Top 0.762: v63.37,18.41 62.1,19.68 61.85,19.68
  Bottom 0.508: v81.92,25.78 81.92,24.89 83.19,23.62 84.45,23.62 D1.A v84.45,22.35 | v82.42,7.87 82.68,7.62 82.68,6.48 LED1.A | v42.67,15.88 v43.81,17.02 | v60.07,23.5 59.31,24.26 v59.31,33.91 59.31,35.14 D6.1 D6.2 D6.3
  Bottom 0.762: v63.37,18.41 63.37,12.83 | 63.37,12.83 63.37,7.95 63.83,7.49 LEDS.4 | JP4.PWR 72.03,12.83 63.37,12.83
VIN  (via drill 0.35)
  Top 0.457: v32.64,12.07 32.64,13.34 34.16,13.34 D10.A | v8.26,13.34 7.49,12.57 v6.98,12.57
  Bottom 0.457: JP6.4 v6.98,12.57 | v32.64,12.07 9.52,12.07 v8.26,13.34
VO  (via drill 0.35)
  Top 0.254: U9.P$3 40.51,44.96 42.67,47.12 53.85,47.12 58.29,42.67 v58.29,42.55 | v68.96,43.82 74.68,43.82 CTRST.2
  Bottom 0.254: v68.96,43.82 67.69,42.55 v58.29,42.55

### Text on the board
tPlace: GND | VCC | TXO | RXI | GND | DTR | GND | SCK | VCC | MISO | MOSI | RST | TX | TX | RX | RX | V+ | V+ | GND | GND | VCC | POT | LED | GND
bPlace: GND | VCC | TXO | RXI | GND | DTR | GND | SCK | VCC | MISO | MOSI | RST | MotionSign V1 | Contains FCC ID / 2ADUIESP-12 | TX | RX | V+ | ESP8266 WiFi / 3.3V Logic Level / To Bootload: / hold down GPIO0 / during reset | GPIO0 | Reset | GND | GND | MISO | SCK | VCC
tNames: RESERVED? | OCCUPIED? | POT
bNames: MOTION? | <-InTentss=Designs-> / ||-MotionSign V1-|| | LEDS | POWER? | VCC: 5V
Document: Valid combinations: | 168V / 3.3V Reg / 8MHz | 168 / 5V Reg / 16MHz | 168 / 5V Reg / 20MHz | Mark back accordingly
tDocu: Original Arduino Mini Design by Team Arduino / Arduino Pro Mini Design by SparkFun Electronics / Revised by Pete Lewis, OfficeSensor by Benjamin Guest